# Altium schematic sheet CLOCK+IO.schdoc
size 548 x 259 mm
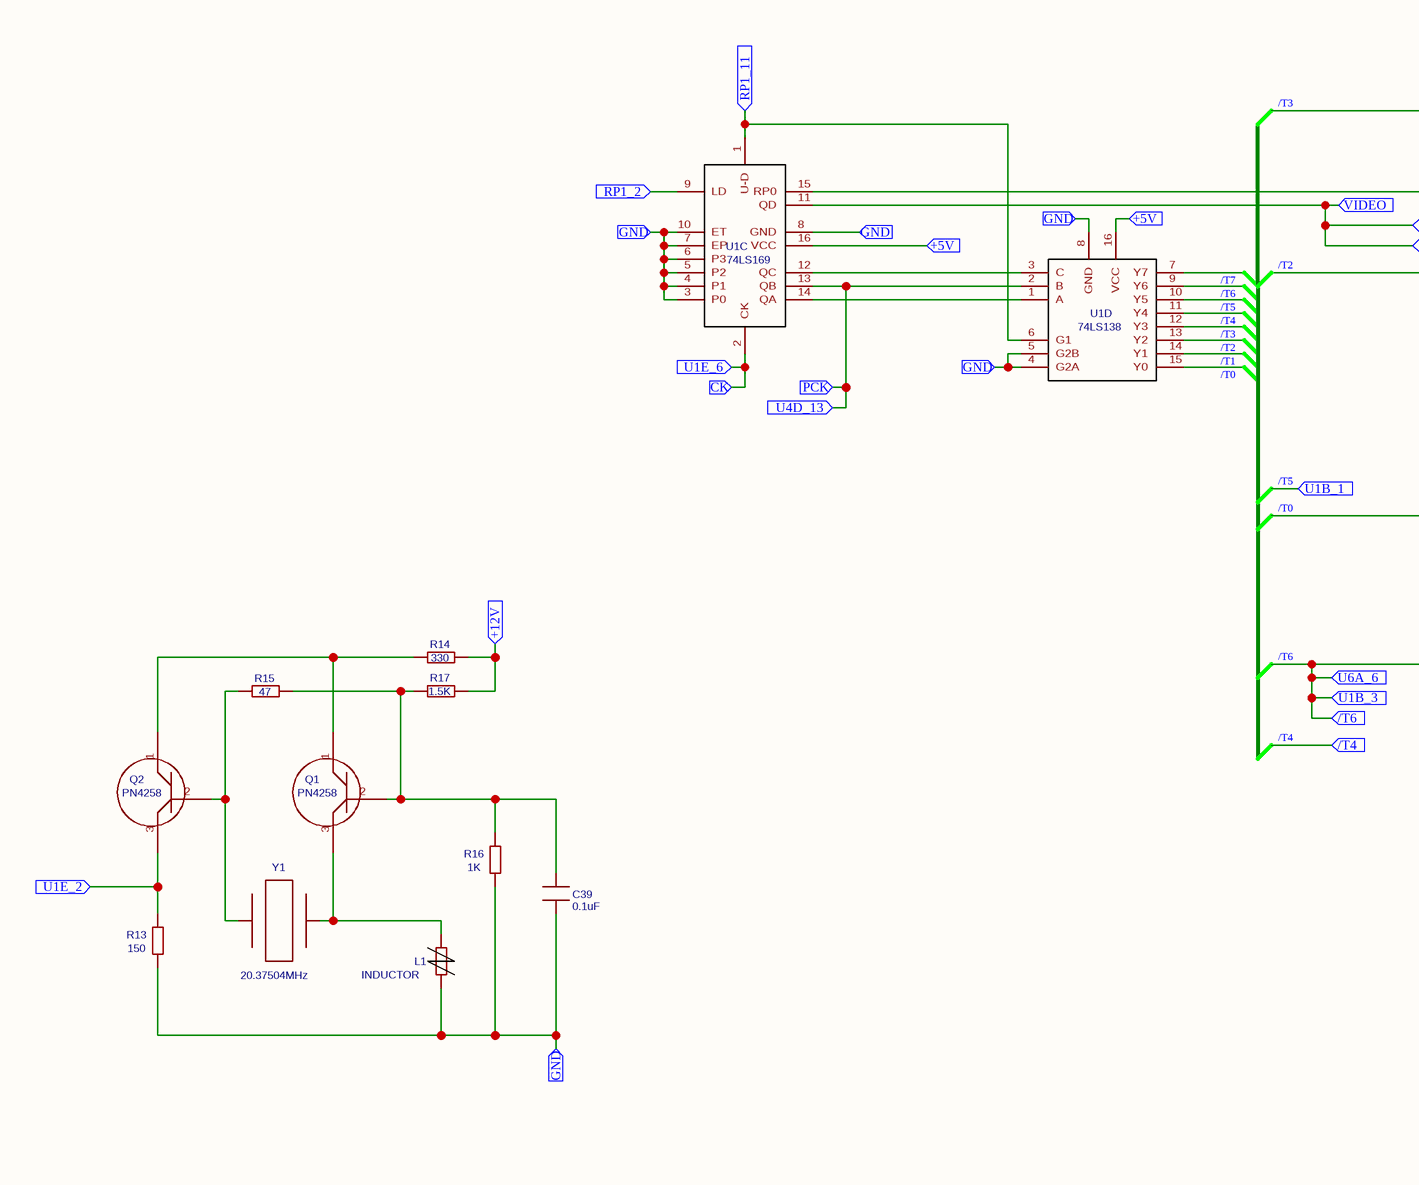
[diagram p0: CLOCK+IO.schdoc, left]
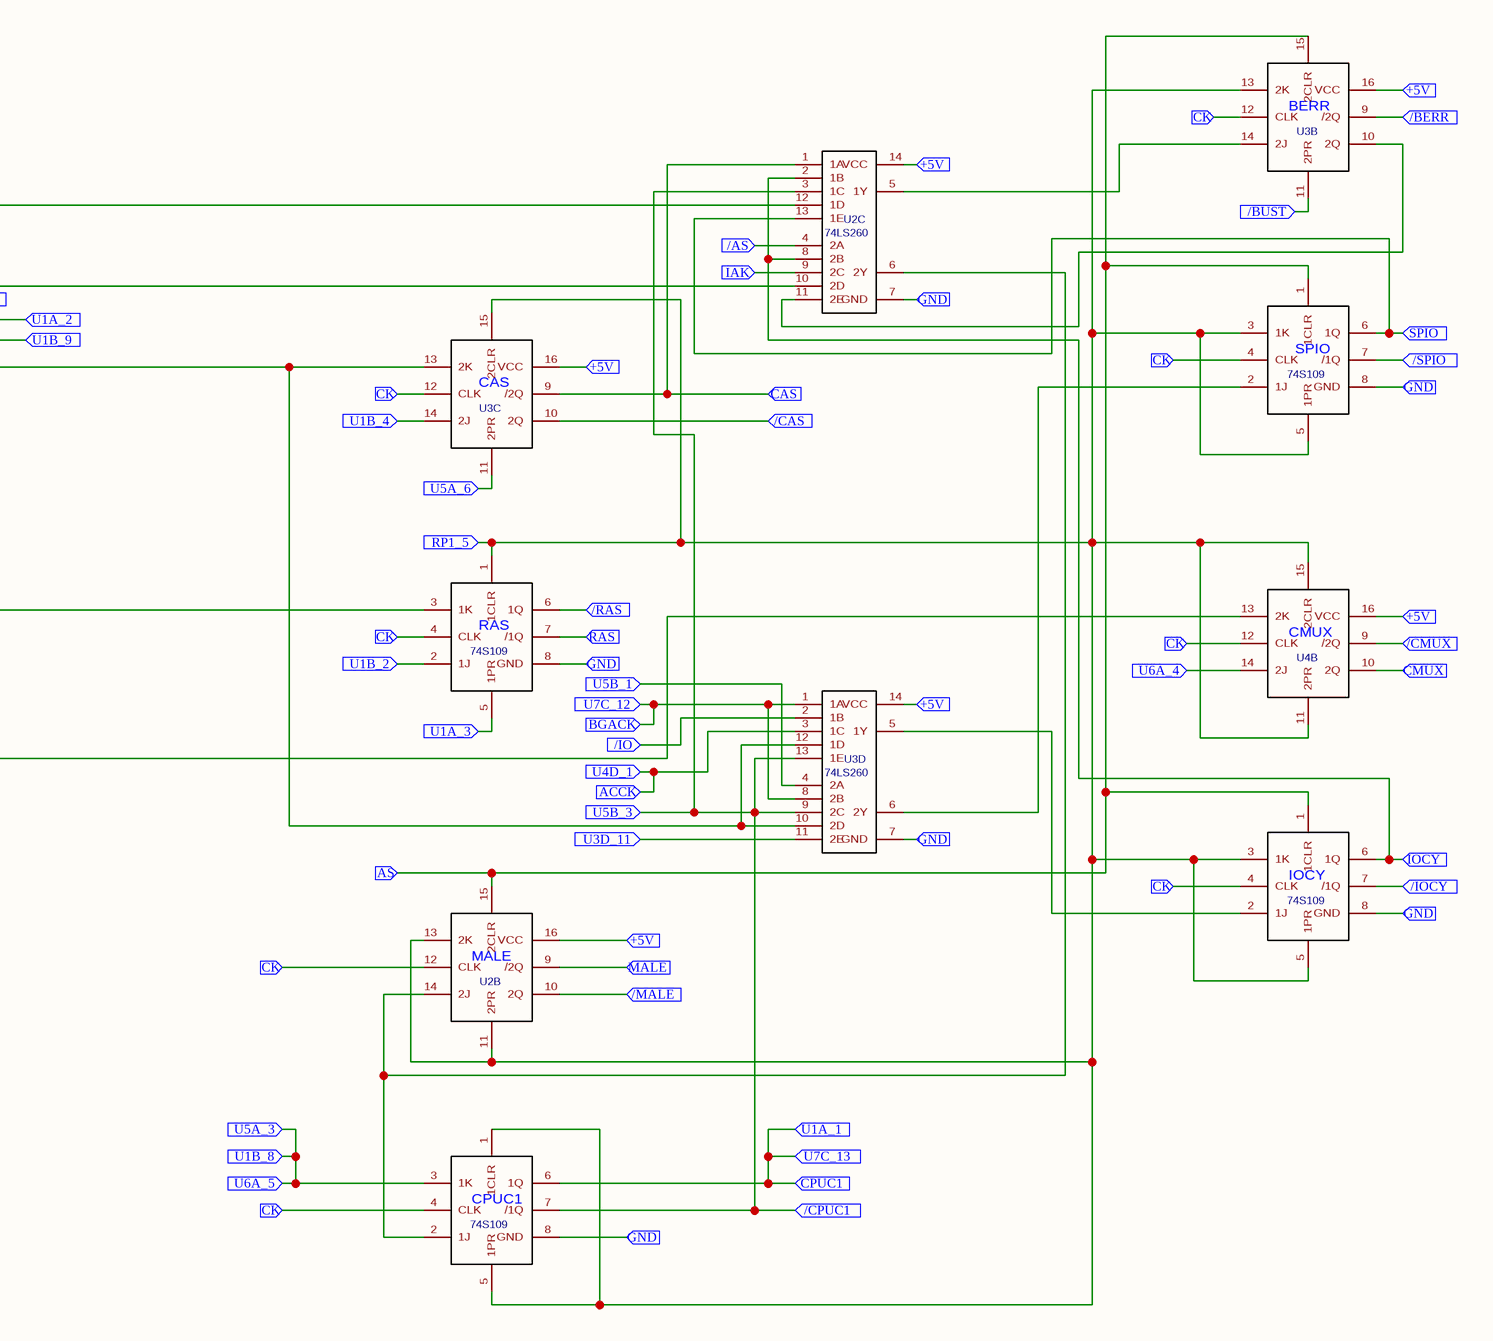
[diagram p1: CLOCK+IO.schdoc, right]

## Parts
C39  0.1uF  [LISA_RESISTOR]
L1  INDUCTOR  [LISA_RESISTOR]
Q1  PN4258  [LISA_CPU_TRANSISTOR]
Q2  PN4258  [LISA_CPU_TRANSISTOR]
R13  150  [LISA_RESISTOR]
R14  330  [LISA_RESISTOR]
R15  47  [LISA_RESISTOR]
R16  1K  [LISA_RESISTOR]
R17  1.5K  [LISA_RESISTOR]
U1C  74LS169  [LISA_DIP_16]
U1D  74LS138  [LISA_DIP_16]
U2B  74S109  [LISA_DIP_16]
U2C  74LS260  [LISA_DIP_14]
U3B  74S109  [LISA_DIP_16]
U3C  74S109  [LISA_DIP_16]
U3D  74LS260  [LISA_DIP_14]
U4B  74S109  [LISA_DIP_16]
Y1  20.37504MHz  [LISA_CPU_XTAL]

## Ports
+5V (in), +12V (in), /AS (in), /BERR (in), /BUST (in), /CAS (in), /CMUX (in), /CPUC1 (in), /IO (in), /IOCY (in), /MALE (in), /RAS (in), /SPIO (in), /T4 (in), /T6 (in), ACCK (in), AS (in), BGACK (in), CAS (in), CK (in), CMUX (in), CPUC1 (in), GND (in), IAK (in), IOCY (in), MALE (in), PCK (in), RAS (in), RP1_2 (in), RP1_5 (in), RP1_11 (in), SPIO (in), U1A_1 (in), U1A_2 (in), U1A_3 (in), U1B_1 (in), U1B_2 (in), U1B_3 (in), U1B_4 (in), U1B_8 (in), U1B_9 (in), U1E_2 (in), U1E_6 (in), U3D_11 (in), U4D_1 (in), U4D_13 (in), U5A_3 (in), U5A_6 (in), U5B_1 (in), U5B_3 (in), U6A_4 (in), U6A_5 (in), U6A_6 (in), U7C_12 (in), U7C_13 (in), VIDEO (in)

## Nets
+5V: U1C.16(VCC) U1D.16(VCC) U2B.16(VCC) U2C.14(VCC) U3B.16(VCC) U3C.16(VCC) U3D.14(VCC) U4B.16(VCC) ; port +5V
+12V: R14.2 R17.2 ; port +12V
/AS: U2C.4(2A) ; port /AS
/BERR: U3B.9(/2Q) ; port /BERR
/BUST: U3B.11(2PR) ; port /BUST
/CAS: U3C.10(2Q) ; port /CAS
/CMUX: U4B.9(/2Q) ; port /CMUX
/CPUC1: U2B.7(/1Q) U2C.3(1C) U3D.9(2C) U3D.13(1E) ; port /CPUC1, port U5B_3
/IO: U3D.2(1B) ; port /IO
/IOCY: U4B.7(/1Q) ; port /IOCY
/MALE: U2B.10(2Q) ; port /MALE
/RAS: U3C.6(1Q) ; port /RAS
/SPIO: U3B.7(/1Q) ; port /SPIO
/T0: U1D.15(Y0) U3C.3(1K)
/T1: U1D.14(Y1)
/T2: U1D.13(Y2) U3C.13(2K) U3D.10(2D) U3D.12(1D)
/T3: U1D.12(Y3) U2C.12(1D)
/T4: U1D.11(Y4) ; port /T4
/T5: U1D.10(Y5) ; port U1B_1
/T6: U1D.9(Y6) U4B.13(2K) ; port U6A_6, port U1B_3, port /T6
/T7: U1D.7(Y7)
ACCK: U3D.3(1C) ; port U4D_1, port ACCK
AS: U2B.15(2CLR) U3B.1(1CLR) U3B.15(2CLR) U4B.1(1CLR) ; port AS
BGACK: U3D.1(1A) U3D.8(2B) ; port U7C_12, port BGACK
CAS: U2C.1(1A) U3C.9(/2Q) ; port CAS
CK: U1C.2(CK) U2B.4(CLK) U2B.12(CLK) U3B.4(CLK) U3B.12(CLK) U3C.4(CLK) U3C.12(CLK) U4B.4(CLK) U4B.12(CLK) ; port U1E_6, port CK
CMUX: U4B.10(2Q) ; port CMUX
CPUC1: U2B.6(1Q) ; port CPUC1, port U7C_13, port U1A_1
GND: C39.2 L1.2 R13.1 R16.1 U1C.3(P0) U1C.4(P1) U1C.5(P2) U1C.6(P3) U1C.7(EP) U1C.8(GND) U1C.10(ET) U1D.4(G2A) U1D.5(G2B) U1D.8(GND) U2B.8(GND) U2C.7(GND) U3B.8(GND) U3C.8(GND) U3D.7(GND) U4B.8(GND) ; port GND
IAK: U2C.9(2C) ; port IAK
IOCY: U2C.2(1B) U2C.8(2B) U4B.6(1Q) ; port IOCY
MALE: U2B.9(/2Q) ; port MALE
PCK: U1C.13(QB) U1D.2(B) ; port PCK, port U4D_13
RAS: U3C.7(/1Q) ; port RAS
RP1_2: U1C.9(LD) ; port RP1_2
RP1_5: U2B.1(1CLR) U2B.5(1PR) U2B.11(2PR) U2B.13(2K) U3B.3(1K) U3B.5(1PR) U3B.13(2K) U3C.1(1CLR) U3C.15(2CLR) U4B.3(1K) U4B.5(1PR) U4B.11(2PR) U4B.15(2CLR) ; port RP1_5
RP1_11: U1C.1(U-D) U1D.6(G1) ; port RP1_11
SPIO: U2C.13(1E) U3B.6(1Q) ; port SPIO
U1A_2: U1C.11(QD) ; port VIDEO, port U1A_2, port U1B_9
U1A_3: U3C.5(1PR) ; port U1A_3
U1B_2: U3C.2(1J) ; port U1B_2
U1B_4: U3C.14(2J) ; port U1B_4
U1B_8: U2B.3(1K) ; port U6A_5, port U1B_8, port U5A_3
U1E_2: Q2.3 R13.2 ; port U1E_2
U3D_11: U3D.11(2E) ; port U3D_11
U5A_6: U3C.11(2PR) ; port U5A_6
U5B_1: U3D.4(2A) ; port U5B_1
U6A_4: U4B.14(2J) ; port U6A_4
NetC39_1: C39.1 Q1.2 R15.2 R16.2 R17.1
NetL1_1: L1.1 Q1.3 Y1.2
NetQ1_1: Q1.1 Q2.1 R14.1
NetQ2_2: Q2.2 R15.1 Y1.1
NetU1C_12: U1C.12(QC) U1D.3(C)
NetU1C_14: U1C.14(QA) U1D.1(A)
NetU1C_15: U1C.15(RP0) U2C.10(2D)
NetU2B_2: U2B.2(1J) U2B.14(2J) U2C.6(2Y)
NetU2C_5: U2C.5(1Y) U3B.14(2J)
NetU2C_11: U2C.11(2E) U3B.10(2Q)
NetU3B_2: U3B.2(1J) U3D.6(2Y)
NetU3D_5: U3D.5(1Y) U4B.2(1J)

## Notes on the sheet
- (near U3B) BERR
- (near U3B) SPIO
- (near U3C) CAS
- (near U3C) RAS
- (near U4B) CMUX
- (near U4B) IOCY
- (near U2B) MALE
- (near U2B) CPUC1

## Library data of the parts
C39 = 0.1uF: Contributor: William Tooker; spicePre: C; spiceSymbolName: LISA_CPU_GLASS_CAP
L1 = INDUCTOR: Contributor: William Tooker; spicePre: L; spiceSymbolName: LISA_CPU_INDUCTOR
Q1 Q2 = PN4258: Contributor: William Tooker; spicePre: Q; spiceSymbolName: LISA_CPU_TRANSISTOR
R13 = 150: Contributor: William Tooker; spicePre: R; spiceSymbolName: LISA_CPU_RESISTOR
R14 = 330: Contributor: William Tooker; spicePre: R; spiceSymbolName: LISA_CPU_RESISTOR
R15 = 47: Contributor: William Tooker; spicePre: R; spiceSymbolName: LISA_CPU_RESISTOR
R16 = 1K: Contributor: William Tooker; spicePre: R; spiceSymbolName: LISA_CPU_RESISTOR
R17 = 1.5K: Contributor: William Tooker; spicePre: R; spiceSymbolName: LISA_CPU_RESISTOR
U1C = 74LS169: Contributor: William Tooker; spicePre: U; spiceSymbolName: LISA_CPU_74LS169
U1D = 74LS138: Contributor: William Tooker; spicePre: U; spiceSymbolName: LISA_CPU_74LS138
U2B U3B U3C U4B = 74S109: Contributor: William Tooker; spicePre: U; spiceSymbolName: LISA_CPU_74S109
U2C U3D = 74LS260: Contributor: William Tooker; spicePre: U; spiceSymbolName: LISA_CPU_74LS260
Y1 = 20.37504MHz: Contributor: William Tooker; spicePre: U; spiceSymbolName: LISA_CPU_XTAL